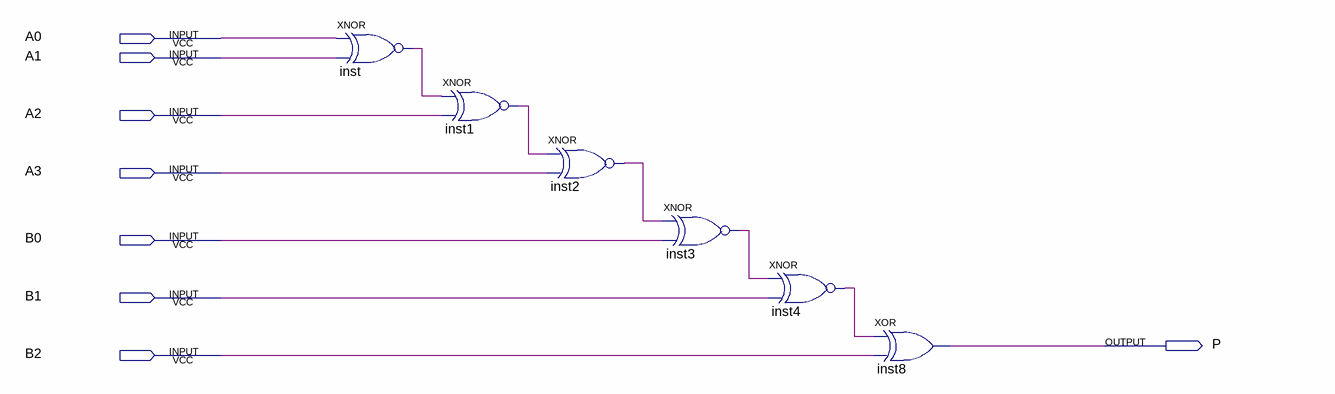
[diagram p0: schematic sheet]
// Quartus schematic paridade.bdf as structural Verilog: 6 symbols, 8 pins
module paridade (
  input  A0,
  input  A1,
  input  A2,
  input  A3,
  input  B0,
  input  B1,
  input  B2,
  output P
);

  wire inst1_out, inst2_out, inst3_out, inst4_out, inst_out;

  xnor inst (inst_out, A0, A1);
  xnor inst1 (inst1_out, inst_out, A2);
  xnor inst2 (inst2_out, inst1_out, A3);
  xnor inst3 (inst3_out, inst2_out, B0);
  xnor inst4 (inst4_out, inst3_out, B1);
  xor inst8 (P, inst4_out, B2);
endmodule
